# Altium schematic sheet Connector.SchDoc: 模板
size A4; Author: Sunduoze; CompanyName: https://sunze.xyz/; Organization: Enze Co.; Revision: V1.0
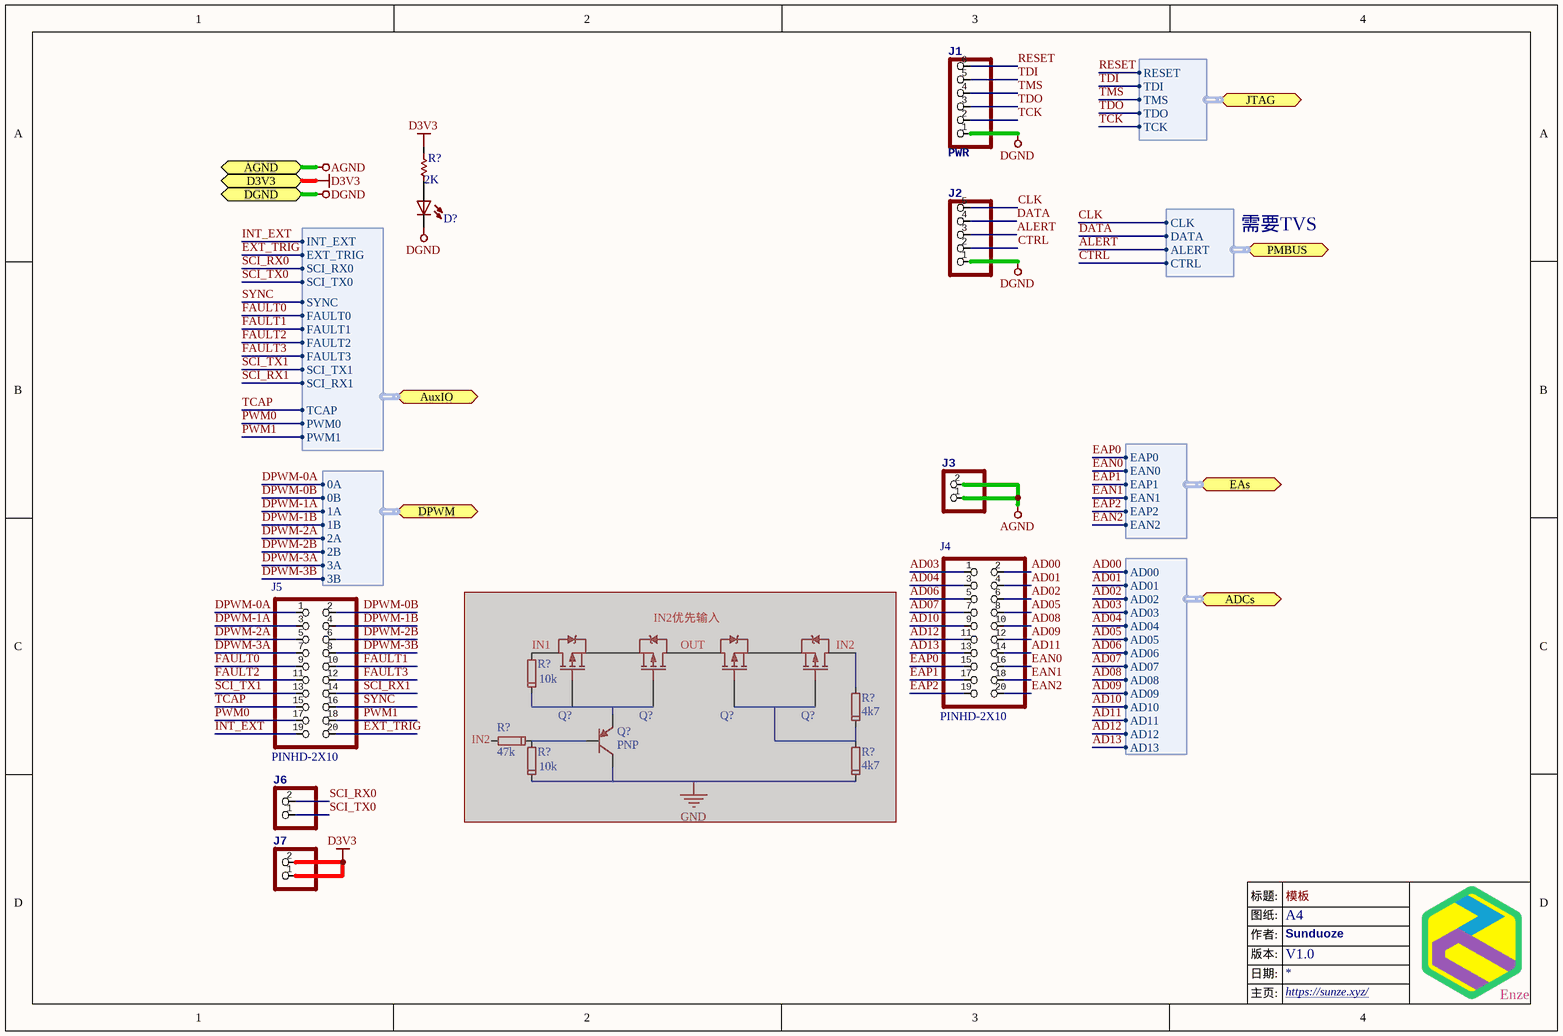
[diagram p0: Connector.SchDoc]

## Parts
(Parts that share a designator on the sheet are numbered #1, #2 ... from top to bottom, then left to right.)
D?  LED  [0603-LED-B]  (value not drawn)
J1  PWR  [1X06]
J2  PWR  [1X05]  (value not drawn)
J3  PWR  [1x02-LVPSFB]  (value not drawn)
J4  PINHD-2X10  [2X10]
J5  PINHD-2X10  [2X10]
J6  PWR  [1x02-LVPSFB]  (value not drawn)
J7  PWR  [1x02-LVPSFB]  (value not drawn)
Q?#1  Comment  (value not drawn)  (masked out: inside a compile mask, not in the netlist)
Q?#2  Comment  (value not drawn)  (masked out: inside a compile mask, not in the netlist)
Q?#3  Comment  (value not drawn)  (masked out: inside a compile mask, not in the netlist)
Q?#4  Comment  (value not drawn)  (masked out: inside a compile mask, not in the netlist)
Q?#5  PNP  [SOT-23-M-BJT]  (masked out: inside a compile mask, not in the netlist)
R?#1  2K  [0603-R-B]
R?#2  10k  [R0603]  (masked out: inside a compile mask, not in the netlist)
R?#3  4k7  [R0603]  (masked out: inside a compile mask, not in the netlist)
R?#4  47k  [R0603]  (masked out: inside a compile mask, not in the netlist)
R?#5  10k  [R0603]  (masked out: inside a compile mask, not in the netlist)
R?#6  4k7  [R0603]  (masked out: inside a compile mask, not in the netlist)

## Ports
ADCs (harness ADCx14), AGND, AuxIO (harness AuxIO), D3V3, DGND, DPWM (harness DPWM), EAs (harness EA), JTAG (harness Debug), PMBUS (harness JTAG)

## Harnesses
DPWM: 0A, 0B, 1B, 1A, 2B, 2A, 3B, 3A
ADCx14: AD00, AD01, AD02, AD03, AD04, AD05, AD06, AD07, AD08, AD09, AD10, AD11, AD12, AD13
EA: EAP0, EAP1, EAP2, EAN0, EAN1, EAN2
AuxIO: INT_EXT, SCI_RX1, TCAP, SCI_TX1, EXT_TRIG, SCI_RX0, SCI_TX0, SYNC, FAULT0, FAULT1, FAULT2, FAULT3, PWM0, PWM1
Debug: TMS, TCK, TDI, TDO, RESET
JTAG: ALERT, DATA, CTRL, CLK

## Nets
AGND: J3.1 J3.2 ; port AGND
D3V3: J7.1 J7.2 R?#1.2 ; port D3V3
DGND: D?.2(C) J1.1 J2.1 ; port DGND
AD00: J4.2 ; port ADCs.AD00
AD01: J4.4 ; port ADCs.AD01
AD02: J4.6 ; port ADCs.AD02
AD03: J4.1 ; port ADCs.AD03
AD04: J4.3 ; port ADCs.AD04
AD05: J4.8 ; port ADCs.AD05
AD06: J4.5 ; port ADCs.AD06
AD07: J4.7 ; port ADCs.AD07
AD08: J4.10 ; port ADCs.AD08
AD09: J4.12 ; port ADCs.AD09
AD10: J4.9 ; port ADCs.AD10
AD11: J4.14 ; port ADCs.AD11
AD12: J4.11 ; port ADCs.AD12
AD13: J4.13 ; port ADCs.AD13
ALERT: J2.3 ; port PMBUS.ALERT
CLK: J2.5 ; port PMBUS.CLK
CTRL: J2.2 ; port PMBUS.CTRL
DATA: J2.4 ; port PMBUS.DATA
DPWM-0A: J5.1 ; port DPWM.0A
DPWM-0B: J5.2 ; port DPWM.0B
DPWM-1A: J5.3 ; port DPWM.1A
DPWM-1B: J5.4 ; port DPWM.1B
DPWM-2A: J5.5 ; port DPWM.2A
DPWM-2B: J5.6 ; port DPWM.2B
DPWM-3A: J5.7 ; port DPWM.3A
DPWM-3B: J5.8 ; port DPWM.3B
EAN0: J4.16 ; port EAs.EAN0
EAN1: J4.18 ; port EAs.EAN1
EAN2: J4.20 ; port EAs.EAN2
EAP0: J4.15 ; port EAs.EAP0
EAP1: J4.17 ; port EAs.EAP1
EAP2: J4.19 ; port EAs.EAP2
EXT_TRIG: J5.20 ; port AuxIO.EXT_TRIG
FAULT0: J5.9 ; port AuxIO.FAULT0
FAULT1: J5.10 ; port AuxIO.FAULT1
FAULT2: J5.11 ; port AuxIO.FAULT2
FAULT3: J5.12 ; port AuxIO.FAULT3
INT_EXT: J5.19 ; port AuxIO.INT_EXT
PWM0: J5.17 ; port AuxIO.PWM0
PWM1: J5.18 ; port AuxIO.PWM1
RESET: J1.6 ; port JTAG.RESET
SCI_RX0: J6.2 ; port AuxIO.SCI_RX0
SCI_RX1: J5.14 ; port AuxIO.SCI_RX1
SCI_TX0: J6.1 ; port AuxIO.SCI_TX0
SCI_TX1: J5.13 ; port AuxIO.SCI_TX1
SYNC: J5.16 ; port AuxIO.SYNC
TCAP: J5.15 ; port AuxIO.TCAP
TCK: J1.2 ; port JTAG.TCK
TDI: J1.5 ; port JTAG.TDI
TDO: J1.3 ; port JTAG.TDO
TMS: J1.4 ; port JTAG.TMS
NetD?_1: D?.1(A) R?#1.1

## Notes on the sheet
- 需要TVS
- IN1
- (near Q?#2) IN2优先输入
- (near Q?#2) OUT
- (near Q?#4) IN2
- (near R?#4) IN2
- 标题:
- 图纸:
- A4
- 作者:
- 日期:
- 版本:
- 主页:
- Enze

## Library data of the parts
J1 = PINHD-1X6: 引脚头
J2 = PINHD-1X5: 引脚头
J3 J6 J7 = PINHD-1X2: 引脚头
J4 J5 = PINHD-2X10: 引脚头; >NAME: J1; >VALUE: PINHD-2X10
Q?#1-Q?#4 = PMOS: P-Channel MOSFET; Note: Pin 2 is electrically connected to pin 4.; Published: 8-Jun-2000; LatestRevisionDate: 17-Jul-2002; LatestRevisionNote: Re-released for DXP Platform.; DatasheetVersion: PD-9.814; PackageVersion: Feb-1997; PackageReference: TO-220AB; Publisher: Altium Limited; PackageDescription: TO, Thru-Hole, Vertical, Heatsink Mounted; 3 In-Line Leads; Pitch 2.54 mm; ComponentLink1Description: Manufacturer Link; ComponentLink1URL: http://www.irf.com/
Q?#5 = PNP: PNP  s8550-2ty(.5A) ss8550-y2(1.5A); Published: 8-Jun-2000; LatestRevisionDate: 15-Jan-2003; LatestRevisionNote: PCB Footprint 'BCY-W3/D4.7' replaced; DatasheetVersion: 1997; PackageVersion: Sep-1998; PackageReference: TO-92A; Publisher: Altium Limited; PackageDescription: TO, Flat Index; 3 In-Line, Axial Leads; Body Dia. 4.5mm; Leads 0.51 x 0.48 mm (max); ComponentLink1Description: Manufacturer Link; ComponentLink1URL: http://www.fairchildsemi.com/; ComponentLink2Description: Datasheet; ComponentLink2URL: http://www.fairchildsemi.com/ds/2N%2F2N3906.pdf
R?#1 = Resistor-E: 电阻; Sim Note: Enter the Resistance value and the set point into parameter fields.; Set Position: 0.5; Value: 1K; Published: 8-Jun-2000; LatestRevisionDate: 17-Jul-2002; LatestRevisionNote: Re-released for DXP Platform.; PackageReference: VR5; Publisher: Altium Limited
R?#2-R?#6 = Resistor
D? = LED: Published: 8-Jun-2000; LatestRevisionDate: 17-Dec-2003; LatestRevisionNote: PCB Footprint replaced.; DatasheetVersion: 16-Apr-2002; PackageVersion: 16-Apr-2002; PackageReference: 3.5X2.8X1.9; Publisher: Altium Limited; PackageDescription: SM LED; 2 C-Bend Leads; Body 3.5 x 2.8 x 1.9 mm, inc leads (LxWxH typ)